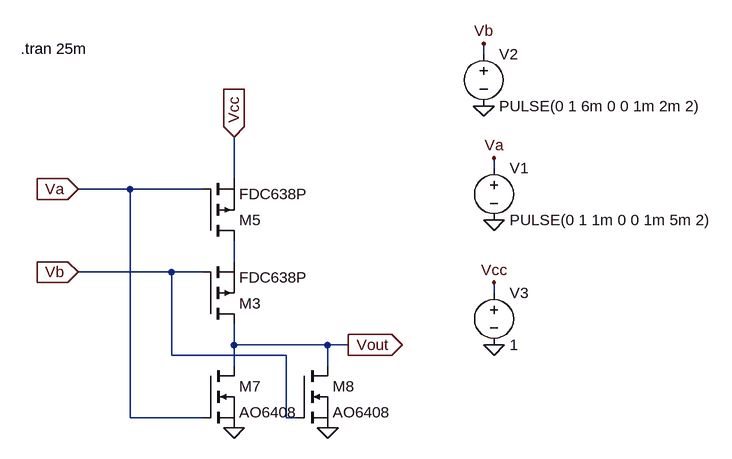
[diagram p0: schematic NOR.asc]
NOR.asc, the LTspice schematic file:
Version 4
SHEET 1 1332 800
WIRE 752 16 752 0
WIRE 768 192 768 176
WIRE 368 208 368 144
WIRE 208 224 128 224
WIRE 320 224 208 224
WIRE 368 336 368 304
WIRE 272 352 128 352
WIRE 320 352 272 352
WIRE 768 384 768 368
WIRE 368 464 368 432
WIRE 512 464 368 464
WIRE 544 464 512 464
WIRE 272 480 272 352
WIRE 448 480 272 480
WIRE 368 496 368 464
WIRE 512 496 512 464
WIRE 208 576 208 224
WIRE 320 576 208 576
WIRE 448 576 448 480
WIRE 464 576 448 576
FLAG 368 144 Vcc
IOPIN 368 144 In
FLAG 544 464 Vout
IOPIN 544 464 Out
FLAG 128 224 Va
IOPIN 128 224 In
FLAG 128 352 Vb
IOPIN 128 352 In
FLAG 368 592 0
FLAG 512 592 0
FLAG 752 96 0
FLAG 768 272 0
FLAG 752 0 Vb
FLAG 768 176 Va
FLAG 768 464 0
FLAG 768 368 Vcc
SYMBOL pmos 320 304 M180
SYMATTR InstName M5
SYMATTR Value FDC638P
SYMBOL nmos 320 496 R0
SYMATTR InstName M7
SYMATTR Value AO6408
SYMBOL nmos 464 496 R0
SYMATTR InstName M8
SYMATTR Value AO6408
SYMBOL pmos 320 432 M180
SYMATTR InstName M3
SYMATTR Value FDC638P
SYMBOL voltage 768 176 R0
SYMATTR InstName V1
SYMATTR Value PULSE(0 1 1m 0 0 1m 5m 2)
SYMBOL voltage 752 0 R0
SYMATTR InstName V2
SYMATTR Value PULSE(0 1 6m 0 0 1m 2m 2)
SYMBOL voltage 768 368 R0
SYMATTR InstName V3
SYMATTR Value 1
TEXT 40 8 Left 2 !.tran 25m

The netlist it stands for:
* NOR.asc
M5 N001 Va Vcc Vcc FDC638P
M7 Vout Va 0 0 AO6408
M8 Vout Vb 0 0 AO6408
M3 Vout Vb N001 N001 FDC638P
V1 Va 0 PULSE(0 1 1m 0 0 1m 5m 2)
V2 Vb 0 PULSE(0 1 6m 0 0 1m 2m 2)
V3 Vcc 0 1
.model NMOS NMOS
.model PMOS PMOS
.lib standard.mos
.tran 25m
.backanno
.end